# EAGLE design tuggerTrackerV1 (EAGLE 8.6.0)
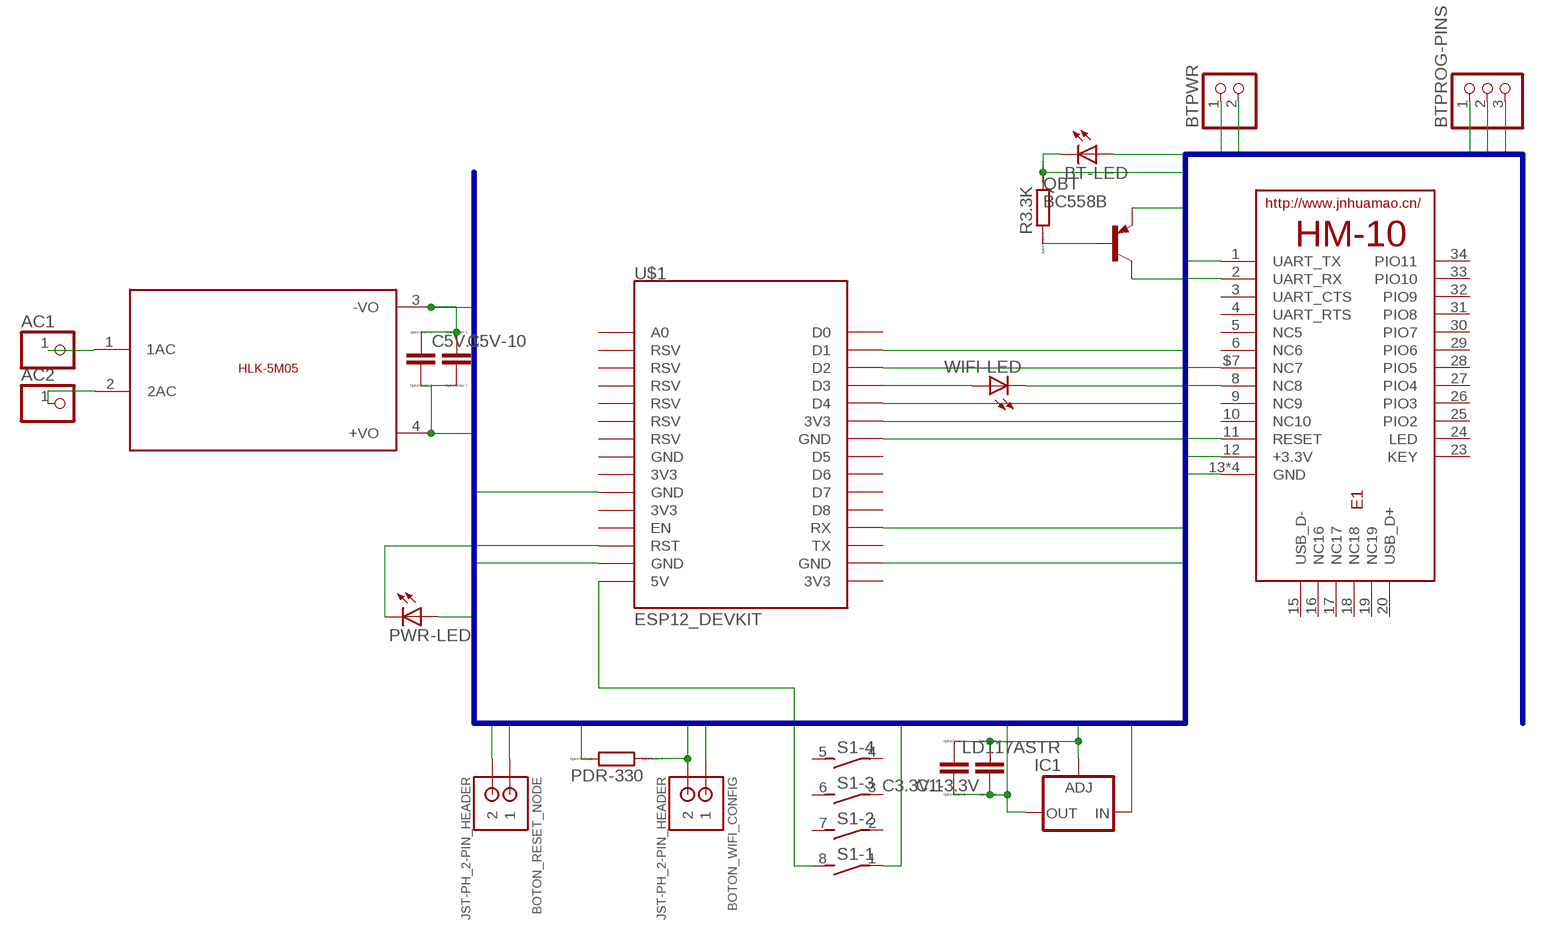
[diagram p0: schematic, sheet 1]

## Parts
AC1  PINHD-1X1  [1X01]
AC2  PINHD-1X1  [1X01]
BOTON_RESET_NODE  JST-PH_2-PIN_HEADER  [JST_B2B-PH_HEADER]
BOTON_WIFI_CONFIG  JST-PH_2-PIN_HEADER  [JST_B2B-PH_HEADER]
BT-LED  LEDCHIPLED_1206  [CHIPLED_1206]
BTPROG-PINS  PINHD-1X3  [1X03]
BTPWR  PINHD-1X2  [1X02]
C1-3.3V  CC0603  [C0603]
C3.3V.1  CC0603  [C0603]
C5V-10  CC0603  [C0603]
C5V.1  CC0603  [C0603]
E1  HM-10-BOARD  [26.9X13X2.2_BOARD]
IC1  LD117ASTR  [SOT223]
PDR-330  RR1206  [R1206]
PWR-LED  LEDCHIPLED_1206  [CHIPLED_1206]
QBT  BC558B  [TO92-EBC]
R3.3K  RR1206  [R1206]
S1  DIP04S  [DIP04S]
U$1  ESP12_DEVKIT  [ESP12_DEVKIT]
U$2  5VDC/5W  HLK-5M05  [HLK-5M05]
WIFI-LED  LEDCHIPLED_1206  [CHIPLED_1206]

## Nets
BTPG1: BTPROG-PINS.1 E1.$7(NC7)
BTPG2: BTPROG-PINS.2 E1.8(NC8)
BTRST: BTPROG-PINS.3 E1.11(RESET)
BTVCC: E1.12(+3.3V) QBT.C
D1: BT-LED.C R3.3K.2 U$1.D1
D2: BOTON_WIFI_CONFIG.P2 PDR-330.1 U$1.D2
GND: BOTON_RESET_NODE.P2 BTPWR.1 C1-3.3V.2 C3.3V.1.2 C5V-10.1 C5V.1.1 E1.13(GND) E1.14(GND) E1.21(GND) E1.22(GND) IC1.1(ADJ) PDR-330.2 PWR-LED.C U$1.GND@0(GND) U$1.GND@1(GND) U$1.GND@2(GND) U$1.GND@3(GND) U$2.3(-VO) WIFI-LED.C
N$2: QBT.B R3.3K.1
N$3: AC1.1 U$2.1(1AC)
N$4: S1.8 U$1.5V
N$5: AC2.1 U$2.2(2AC)
N$6: U$1.D3 WIFI-LED.A
NODRST: BOTON_RESET_NODE.P1 U$1.RST
NRXBTX: E1.1(UART_TX) U$1.RX
NTXBRX: E1.2(UART_RX) U$1.D4
V3NODE: BOTON_WIFI_CONFIG.P1 BT-LED.A PWR-LED.A U$1.3V3@1(3V3)
V3REG: C1-3.3V.1 C3.3V.1.1 IC1.4(OUT) QBT.E
VIN: BTPWR.2 C5V-10.2 C5V.1.2 IC1.3(IN) S1.1 U$2.4(+VO)
Unconnected: E1.3(UART_CTS) E1.4(UART_RTS) E1.5(NC5) E1.6(NC6) E1.9(NC9) E1.10(NC10) E1.15(USB_D-) E1.16(NC16) E1.17(NC17) E1.18(NC18) E1.19(NC19) E1.20(USB_D+) E1.23(KEY) E1.24(LED) E1.25(PIO2) E1.26(PIO3) E1.27(PIO4) E1.28(PIO5) E1.29(PIO6) E1.30(PIO7) E1.31(PIO8) E1.32(PIO9) E1.33(PIO10) E1.34(PIO11) S1.2 S1.3 S1.4 S1.5 S1.6 S1.7 U$1.3V3@0(3V3) U$1.3V3@2(3V3) U$1.3V3@3(3V3) U$1.A0 U$1.D0 U$1.D5 U$1.D6 U$1.D7 U$1.D8 U$1.EN U$1.GND@4(GND) U$1.RSV@0(RSV) U$1.RSV@1(RSV) U$1.RSV@2(RSV) U$1.RSV@3(RSV) U$1.RSV@4(RSV) U$1.RSV@5(RSV) U$1.TX

## Buses
V3NODE,V3REG,VIN,GND,GNDBT,D1,D2,BTPG1,BTPG2,BTRST,BTVCC,NRXBTX,NTXBRX,NODRST

## Library data of the parts
AC1 AC2 = pinhead:PINHD-1X1: PIN HEADER
BOTON_RESET_NODE BOTON_WIFI_CONFIG = SRG:JST-PH_2-PIN_HEADER: 2-pin JST PH Shrouded Header, top entry P/N B2B-PH-K-S Mating connector PHR-2 Mating cable assembly: Sparkfun PRT-09914 <http://www.sparkfun.com/products/9914>
BT-LED PWR-LED WIFI-LED = led:LED: LED OSRAM: - CHIPLED LG R971, LG N971, LY N971, LG Q971, LY Q971, LO R971, LY R971 LH N974, LH R974 LS Q976, LO Q976, LY Q976 LO Q996 - Hyper CHIPLED LW Q18S LB Q993, LB Q99A, LB R99A - SideLED LS A670, LO A670, LY A670, LG A670, LP A670 LB A673, LV A673, LT A673, LW A673 LH A674 LY A675 LS A676, LA A676, LO A676, LY A676, LW A676 LS A679, LY A679, LG A679 - Hyper Micro SIDELED® LS Y876, LA Y876, LO Y876, LY Y876 LT Y87S - SmartLED LW L88C, LW L88S LB L89C, LB L89S, LG L890 LS L89K, LO L89K, LY L89K LS L896, LA L896, LO L896, LY L896 - TOPLED LS T670, LO T670, LY T670, LG T670, LP T670 LSG T670, LSP T670, LSY T670, LOP T670, LYG T670 LG T671, LOG T671, LSG T671 LB T673, LV T673, LT T673, LW T673 LH T674 LS T676, LA T676, LO T676, LY T676, LB T676, LH T676, LSB T676, LW T676 LB T67C, LV T67C, LT T67C, LS T67K, LO T67K, LY T67K, LW E67C LS E67B, LA E67B, LO E67B, LY E67B, LB E67C, LV E67C, LT E67C LW T67C LS T679, LY T679, LG T679 LS T770, LO T770, LY T770, LG T770, LP T770 LB T773, LV T773, LT T773, LW T773 LH T774 LS E675, LA E675, LY E675, LS T675 LS T776, LA T776, LO T776, LY T776, LB T776 LHGB T686 LT T68C, LB T68C - Hyper Mini TOPLED® LB M676 - Mini TOPLED Santana® LG M470 LS M47K, LO M47K, LY M47K Source: http://www.osram.convergy.de LUXEON: - LUMILED® LXK2-PW12-R00, LXK2-PW12-S00, LXK2-PW14-U00, LXK2-PW14-V00 LXK2-PM12-R00, LXK2-PM12-S00, LXK2-PM14-U00 LXK2-PE12-Q00, LXK2-PE12-R00, LXK2-PE12-S00, LXK2-PE14-T00, LXK2-PE14-U00 LXK2-PB12-K00, LXK2-PB12-L00, LXK2-PB12-M00, LXK2-PB14-N00, LXK2-PB14-P00, LXK2-PB14-Q00 LXK2-PR12-L00, LXK2-PR12-M00, LXK2-PR14-Q00, LXK2-PR14-R00 LXK2-PD12-Q00, LXK2-PD12-R00, LXK2-PD12-S00 LXK2-PH12-R00, LXK2-PH12-S00 LXK2-PL12-P00, LXK2-PL12-Q00, LXK2-PL12-R00 Source: www.luxeon.com KINGBRIGHT: KA-3528ASYC Source: www.kingbright.com
BTPROG-PINS = pinhead:PINHD-1X3: PIN HEADER
BTPWR = pinhead:PINHD-1X2: PIN HEADER
C1-3.3V C3.3V.1 C5V-10 C5V.1 = eagle-ltspice:C: CAPACITOR, European symbol; SPICEMODEL: NONE; SPICEPREFIX: C
E1 = JNHuaMao:HM-10: HM Bluetooth module use TI CC2540 or CC2541, Master and slave roles in one, transmission version and remote control version and PIO state acquisition functions in one, Support the AT command modify module parameters, Convenient and flexible.
IC1 = v-reg:LD117A?*: Low drop fixed and adjustable positive voltage regulators 1 A Source: http://www.st.com/stonline/products/literature/ds/7194/ld1117axx.pdf
PDR-330 R3.3K = eagle-ltspice:R: RESISTOR, European symbol; SPICEMODEL: NONE; SPICEPREFIX: R
QBT = transistor-pnp:BC558*: PNP Transistror
S1 = switch-dil:DIP04S: DIL/CODE SWITCH; OC_FARNELL: unknown; OC_NEWARK: unknown
U$1 = ESP12_DEVKIT:ESP12_DEVKIT: ESP12 DEVKIT BOARD
U$2 = HLK-5M05:HLK-5M05: HLK-5M05 is an 5Volt/5W smps developed by HI-LINK; SIZE: 23x38(mm)

## Board
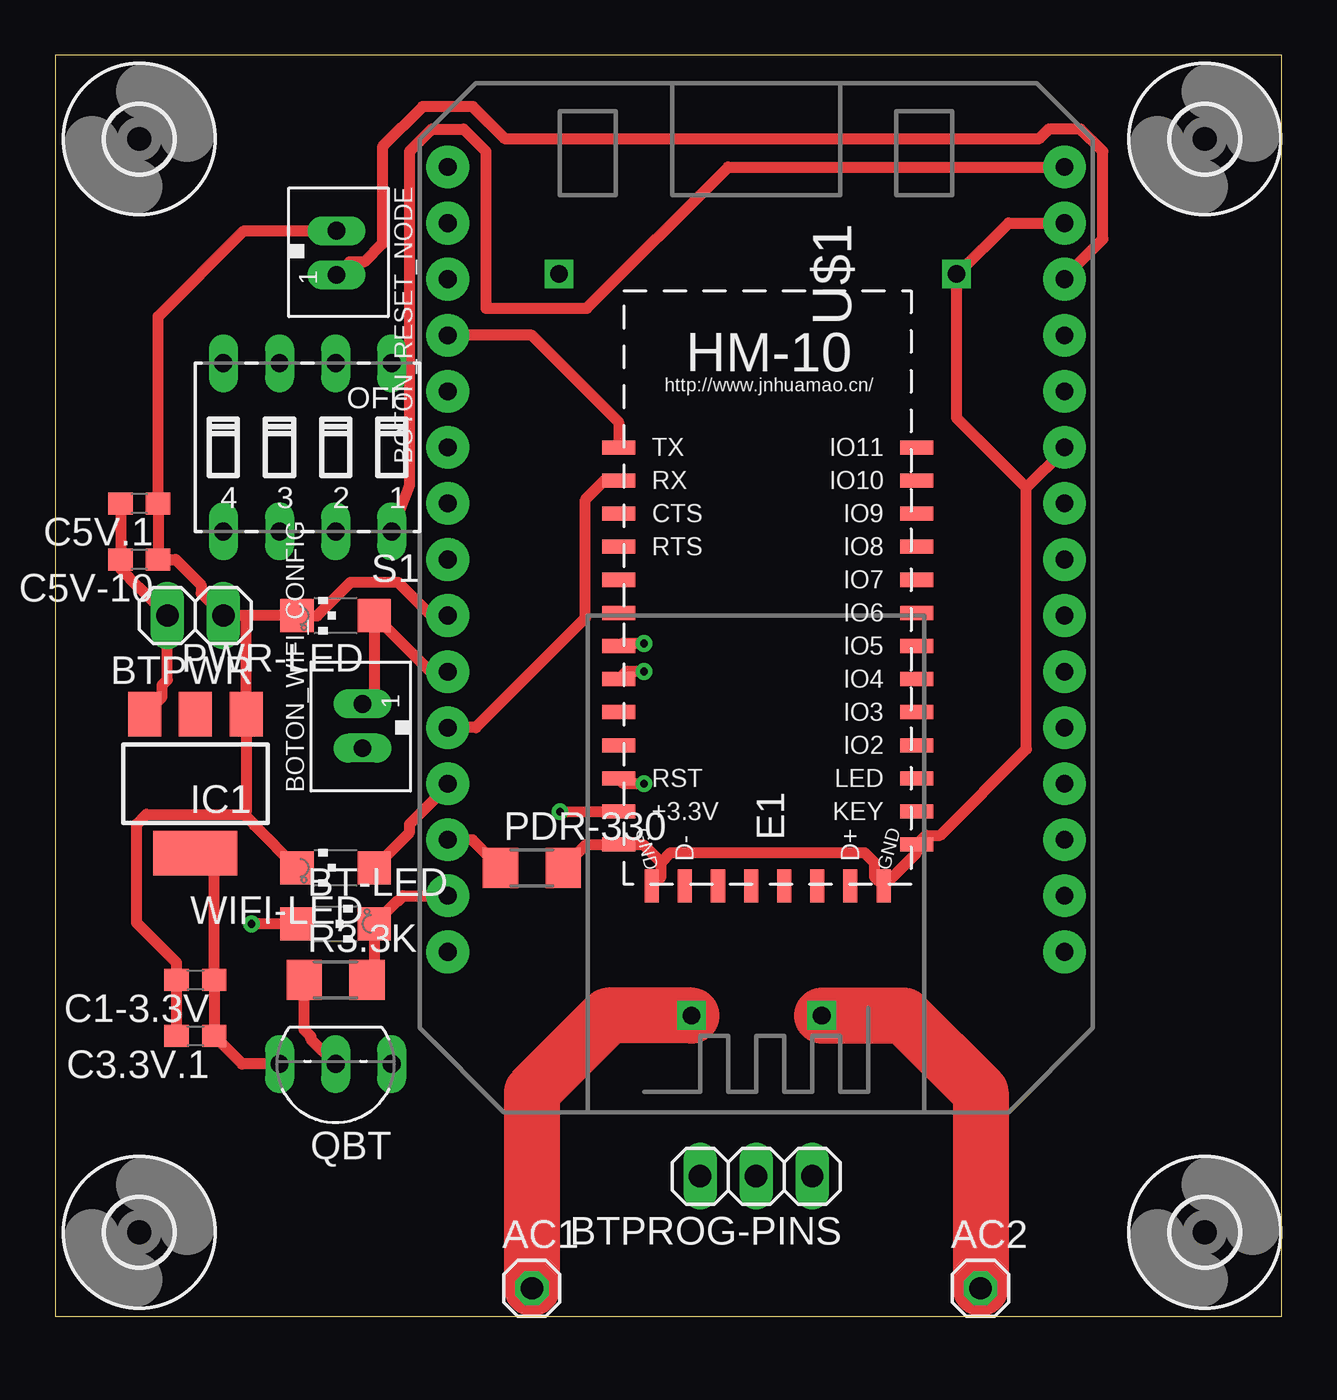
[diagram p1: board, top side]
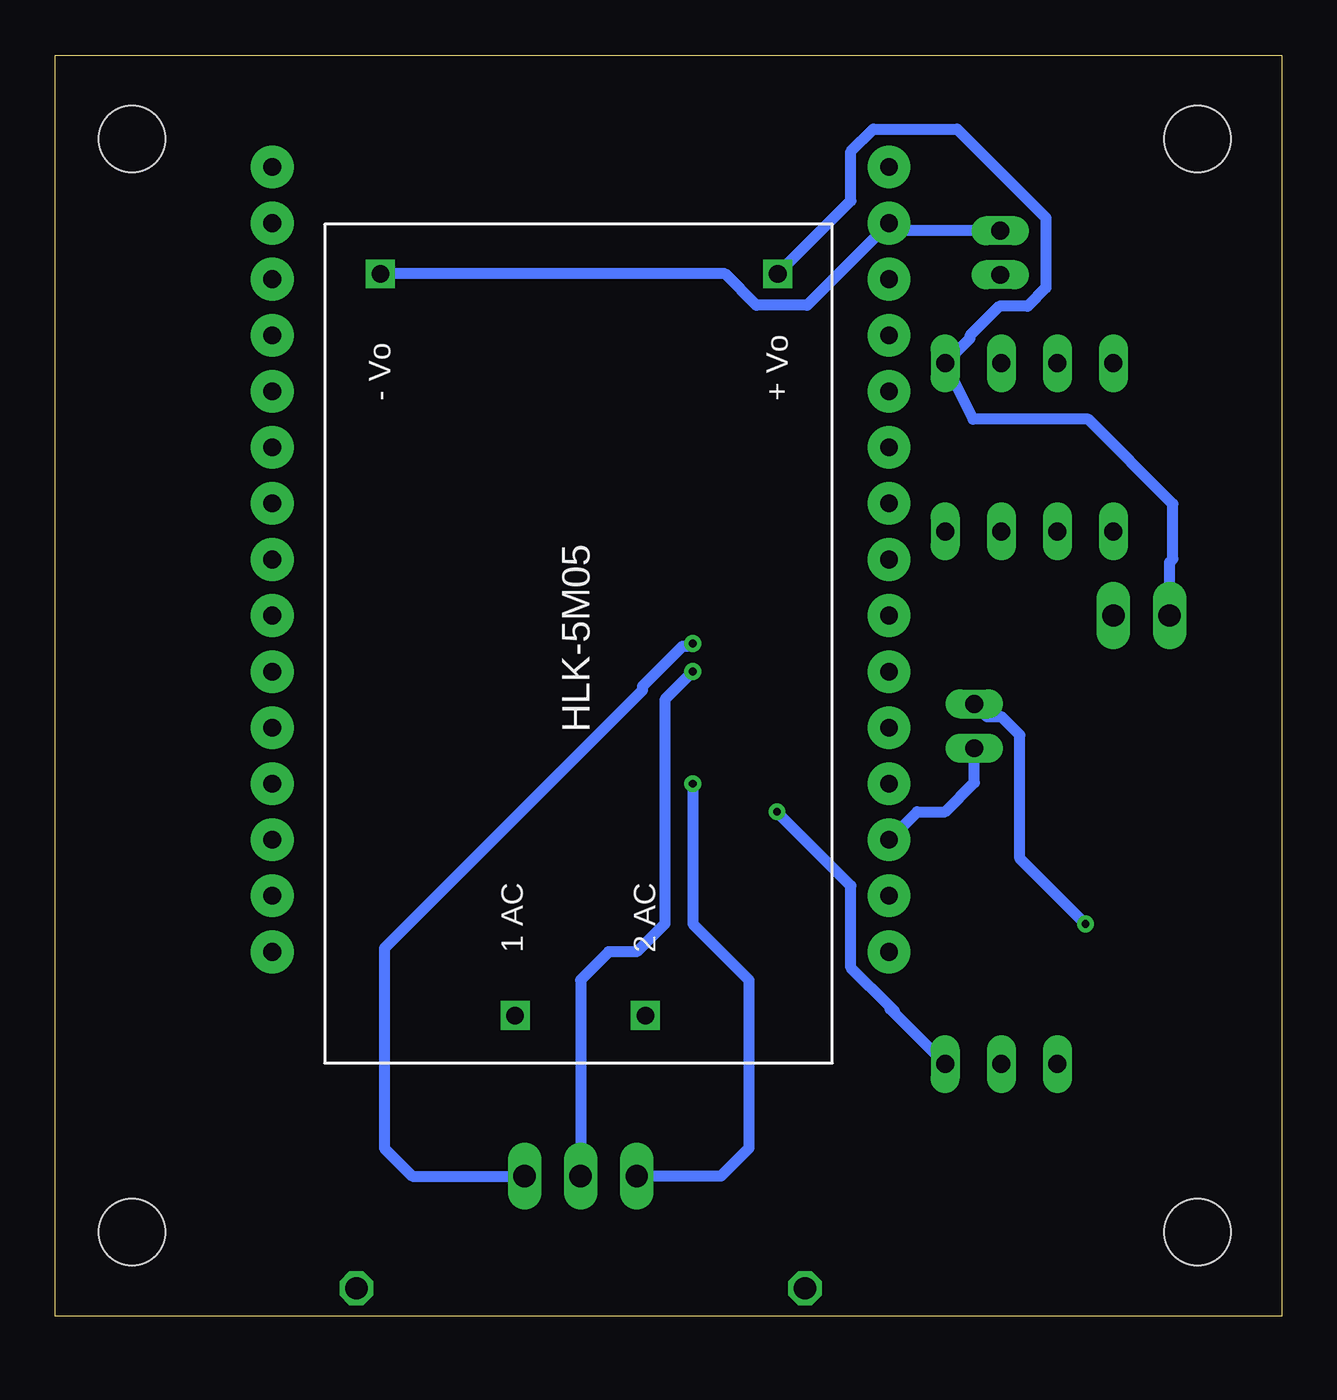
[diagram p2: board, bottom side, seen from below]

Size 55.55 x 57.14 mm. Coordinates in mm from the lower left corner, seen from the top.
Outline: 0,0 55.55,0 55.55,57.14 0,57.14 0,0
Copper layers (1*16): Top 0.035mm / dielectric 1.5mm / Bottom 0.035mm
Design rules "default *": minimum track width 20mil, minimum drill 0.35mm, track to track 20mil, track to pad 20mil, pad to pad 20mil, via to via 20mil, smd to smd 20mil, copper to edge 40mil, drill to drill 20mil, minimum pad ring 10mil, minimum via ring 8mil, stop-mask expansion 4mil, vias tented up to drill 0mil, thermal gap 10mil

### Footprints (pad centres in the part's own frame; a part is rotated, then mirrored left to right if it is on the bottom)
1X01 = drill 1.016 octagon: 1 0,0
JST_B2B-PH_HEADER = drill 0.8 long: P1 1.075,0.048; P2 -0.925,0.048
CHIPLED_1206 = smd 1.5 x 1.5: A 0,-1.75; C 0,1.75
1X03 = drill 1.016 long: 1 -2.54,0; 2 0,0; 3 2.54,0
1X02 = drill 1.016 long: 1 -1.27,0; 2 1.27,0
C0603 = smd 1.1 x 1: 1 -0.85,0; 2 0.85,0
26.9X13X2.2_BOARD = smd 1.5 x 0.635: 1 -7.5,0; 2 -7.5,-1.5; 3 -7.5,-3; 4 -7.5,-4.5; 5 -7.5,-6; 6 -7.5,-7.5; 8 -7.5,-10.5; 9 -7.5,-12; 10 -7.5,-13.5; 11 -7.5,-15; 12 -7.5,-16.5; 13 -7.5,-18; 22 6,-18; 23 6,-16.5; 24 6,-15; 25 6,-13.5; 26 6,-12; 27 6,-10.5; 28 6,-9; 29 6,-7.5; 30 6,-6; 31 6,-4.5; 32 6,-3; 33 6,-1.5; 34 6,0; $7 -7.5,-9 | smd 0.635 x 1.5: 14 -6,-19.875; 15 -4.5,-19.875; 16 -3,-19.875; 17 -1.5,-19.875; 18 0,-19.875; 19 1.5,-19.875; 20 3,-19.875; 21 4.5,-19.875
SOT223 = smd 1.5 x 2: 1 -2.3,-3.15; 2 0,-3.15; 3 2.3,-3.15 | smd 3.8 x 2: 4 0,3.15
R1206 = smd 1.6 x 1.803: 1 -1.422,0; 2 1.422,0
TO92-EBC = drill 0.813 long: B 0,-1.27; C -2.54,-1.27; E 2.54,-1.27
DIP04S = drill 0.813 long: 1 -3.81,-3.81; 2 -1.27,-3.81; 3 1.27,-3.81; 4 3.81,-3.81; 5 3.81,3.81; 6 1.27,3.81; 7 -1.27,3.81; 8 -3.81,3.81
ESP12_DEVKIT = drill 0.8 pad 1.93: 3V3@0 -13.97,-7.62; 3V3@1 13.97,5.08; 3V3@2 13.97,-17.78; 3V3@3 -13.97,-2.54; 5V -13.97,-17.78; A0 -13.97,17.78; D0 13.97,17.78; D1 13.97,15.24; D2 13.97,12.7; D3 13.97,10.16; D4 13.97,7.62; D5 13.97,0; D6 13.97,-2.54; D7 13.97,-5.08; D8 13.97,-7.62; EN -13.97,-10.16; GND@0 -13.97,-5.08; GND@1 -13.97,-15.24; GND@2 13.97,2.54; GND@3 13.97,-15.24; GND@4 -13.97,0; RST -13.97,-12.7; RSV@0 -13.97,15.24; RSV@1 -13.97,12.7; RSV@2 -13.97,10.16; RSV@3 -13.97,7.62; RSV@4 -13.97,5.08; RSV@5 -13.97,2.54; RX 13.97,-10.16; TX 13.97,-12.7
HLK-5M05 = drill 0.8 square: 1 -16.85,-2.93; 2 -16.85,2.97; 3 16.75,9.07; 4 16.75,-8.93
3,0 = hole 3: 0,0

### Placement (x,y rotation side)
AC1  21.59,1.27 0 top
AC2  41.91,1.27 0 top
BOTON_RESET_NODE  12.7,48.26 270 top
BOTON_WIFI_CONFIG  13.97,26.67 90 top
BT-LED  12.7,17.78 270 top
BTPROG-PINS  31.75,6.35 180 top
BTPWR  6.35,31.75 180 top
C1-3.3V  6.35,15.24 180 top
C3.3V.1  6.35,12.7 180 top
C5V-10  3.81,34.29 180 top
C5V.1  3.81,36.83 180 top
E1  33.02,39.37 0 top
IC1  6.35,24.13 180 top
PDR-330  21.59,20.32 0 top
PWR-LED  12.7,31.75 90 top
QBT  12.7,10.16 180 top
R3.3K  12.7,15.24 0 top
S1  11.43,39.37 180 top
U$1  31.75,34.29 180 top
U$2  31.75,30.48 90 bottom
U$6  [3,0]  3.81,53.34 0 top
U$7  [3,0]  52.07,53.34 0 top
U$8  [3,0]  3.81,3.81 0 top
U$9  [3,0]  52.07,3.81 0 top
WIFI-LED  12.7,20.32 90 top

### Tracks (layer width: path | path; a pad name or v marks a point on that pad's centre or on a via)
BTPG1  (via drill 0.35)
  Top 0.508: v26.67,30.48 25.63,30.48 E1.$7
  Bottom 0.508: v26.67,30.48 26.8,30.35 27.14,30.35 28.96,28.54 28.96,28.36 40.64,16.68 40.64,7.62 39.37,6.35 BTPROG-PINS.1
BTPG2  (via drill 0.35)
  Top 0.508: v26.67,29.21 25.86,29.21 E1.8
  Bottom 0.508: v26.67,29.21 27.94,27.94 27.94,17.78 29.21,16.51 30.48,16.51 31.75,15.24 BTPROG-PINS.2
BTRST  (via drill 0.35)
  Top 0.508: v26.67,24.13 25.76,24.13 E1.11
  Bottom 0.508: v26.67,24.13 26.67,17.78 24.13,15.24 24.13,7.62 25.4,6.35 BTPROG-PINS.3
BTVCC  (via drill 0.35)
  Top 0.508: v22.86,22.86 24.14,22.87 E1.12
  Bottom 0.508: v22.86,22.86 19.51,19.51 19.51,15.79 17.73,14.02 | 17.53,13.82 17.73,14.02 | QBT.C 17.73,13.92 17.73,14.02
D1
  Top 0.508: R3.3K.2 14.45,15.57 BT-LED.C 15.48,18.81 15.52,18.81 15.76,19.05 U$1.D1
D2
  Top 0.508: PDR-330.1 18.9,21.59 U$1.D2
  Bottom 0.508: U$1.D2 16.51,22.86 15.24,22.86 13.92,24.18 BOTON_WIFI_CONFIG.P2
GND
  Top 0.508: 27.44,20.56 27.89,21.01 36.65,21.01 37.1,20.56 37.1,19.92 E1.21 39.02,21 E1.22 39.44,21.79 40.09,21.79 43.99,25.7 43.99,37.55 | E1.14 27.44,19.92 27.44,20.56 | 8.89,31.75 PWR-LED.C 11.87,31.75 13.38,33.26 15.52,33.26 17.03,31.75 U$1.GND@2 | 8.89,31.75 BTPWR.1 6.6,32.77 6.6,33.14 5.46,34.29 C5V-10.1 C5V.1.1 4.66,45.3 8.54,49.19 BOTON_RESET_NODE.P2 | 8.89,31.75 8.65,31.51 IC1.1 8.65,22.83 8.57,22.74 | U$1.GND@0 45.72,39.27 43.99,37.55 | PDR-330.2 24.06,21.37 E1.13 26.63,21.37 27.44,20.56 | 43.99,37.55 40.82,40.72 U$2.3 40.88,47.23 43.18,49.53 U$1.GND@1 | C3.3V.1.2 C1-3.3V.2 5.5,16.02 3.69,17.83 3.69,22.3 4.13,22.74 8.57,22.74 | 8.57,22.74 9.01,22.3 9.01,22.26 WIFI-LED.C
  Bottom 0.508: BOTON_RESET_NODE.P2 17.43,49.19 U$1.GND@3 21.5,45.81 23.79,45.81 25.21,47.23 U$2.3
N$2
  Top 0.508: QBT.B 11.58,12.55 11.58,12.68 11.28,12.98 R3.3K.1
N$3
  Top 2.54: U$2.1 25.06,13.63 21.59,10.16 AC1.1
N$4  (via drill 0.35)
  Top 0.508: U$1.5V 30.48,52.07 24.08,45.67 19.51,45.67 19.51,52.78 18.5,53.8 17.07,53.8 16.05,52.78 16.05,37.64 S1.8
  other vias: 45.72,52.07
N$5
  Top 2.54: U$2.2 38.44,13.63 41.91,10.16 AC2.1
N$6
  Top 0.508: WIFI-LED.A 16.05,21.92 16.05,22.3 17.78,24.03 U$1.D3
NODRST
  Top 0.508: U$1.RST 45.72,47.09 47.45,48.81 47.45,52.78 46.44,53.8 45.01,53.8 44.55,53.34 20.39,53.34 18.92,54.81 16.64,54.81 14.82,52.99 14.82,48.6 13.99,47.77 13.33,47.77 BOTON_RESET_NODE.P1
NRXBTX
  Top 0.508: E1.1 25.52,40.52 21.59,44.45 U$1.RX
NTXBRX
  Top 0.508: E1.2 24.88,37.87 24.01,37 24.01,31.63 19.05,26.67 U$1.D4
V3NODE  (via drill 0.35)
  Top 0.508: BT-LED.A v8.89,17.78 | BOTON_WIFI_CONFIG.P1 14.45,28.27 PWR-LED.A 16.99,29.21 U$1.3V3@1
  Bottom 0.508: BOTON_WIFI_CONFIG.P1 13.34,27.16 12.68,27.16 11.85,26.33 11.85,20.74 v8.89,17.78
V3REG
  Top 0.508: IC1.4 7.2,20.13 C1-3.3V.1 C3.3V.1.1 8.47,11.43 QBT.E
VIN
  Top 0.508: 3.81,27.94 3.81,27.52 IC1.3 4.84,28.07 4.84,28.6 5.08,28.84 BTPWR.2 | 4.66,32.17 BTPWR.2 | BTPWR.2 3.8,33.03 3.79,33.03 2.96,33.86 C5V-10.2 C5V.1.2
  Bottom 0.508: BTPWR.2 5.08,34.16 4.93,34.31 4.93,36.81 8.76,40.64 13.97,40.64 S1.1 14.12,44.3 14.12,44.43 12.78,45.77 11.51,45.77 10.68,46.6 10.68,49.77 14.7,53.8 18.5,53.8 19.51,52.78 19.51,50.54 U$2.4